# EAGLE design ME433 (EAGLE 9.6.2)
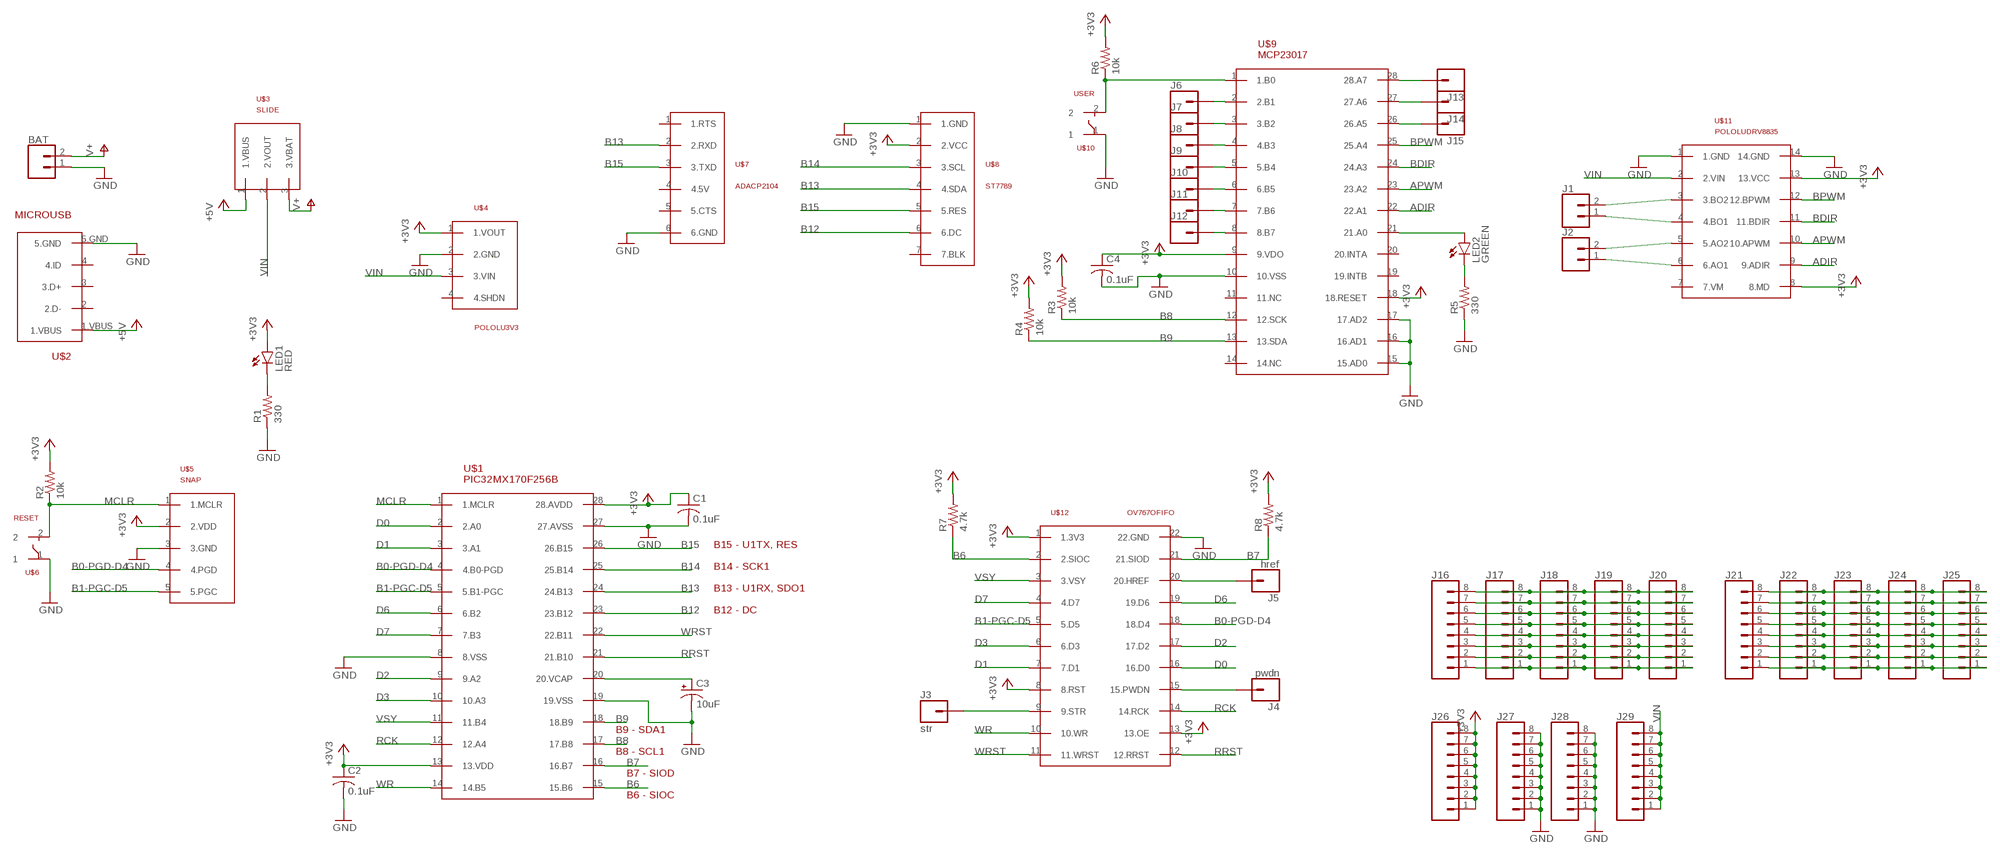
[diagram p0: schematic, sheet 1]

## Parts
BAT  CONN_02  [1X02]
C1  0.1uF  C-US025-030X050  [C025-030X050]
C2  0.1uF  C-US025-030X050  [C025-030X050]
C3  10uF  CPOL-USB45181B  [B45181B]
C4  0.1uF  C-US025-030X050  [C025-030X050]
J1  CONN_02  [1X02]
J2  CONN_02  [1X02]
J3  str  CONN_01  [1X01]
J4  pwdn  CONN_01  [1X01]
J5  href  CONN_01  [1X01]
J6  CONN_01  [1X01]
J7  CONN_01  [1X01]
J8  CONN_01  [1X01]
J9  CONN_01  [1X01]
J10  CONN_01  [1X01]
J11  CONN_01  [1X01]
J12  CONN_01  [1X01]
J13  CONN_01  [1X01]
J14  CONN_01  [1X01]
J15  CONN_01  [1X01]
J16  CONN_08"  [1X08]
J17  CONN_08"  [1X08]
J18  CONN_08"  [1X08]
J19  CONN_08"  [1X08]
J20  CONN_08"  [1X08]
J21  CONN_08"  [1X08]
J22  CONN_08"  [1X08]
J23  CONN_08"  [1X08]
J24  CONN_08"  [1X08]
J25  CONN_08"  [1X08]
J26  CONN_08"  [1X08]
J27  CONN_08"  [1X08]
J28  CONN_08"  [1X08]
J29  CONN_08"  [1X08]
LED1  RED  LED3MM  [LED3MM]
LED2  GREEN  LED3MM  [LED3MM]
R1  330  R-US_0207/10  [0207/10]
R2  10k  R-US_0207/10  [0207/10]
R3  10k  R-US_0207/10  [0207/10]
R4  10k  R-US_0207/10  [0207/10]
R5  330  R-US_0207/10  [0207/10]
R6  10k  R-US_0207/10  [0207/10]
R7  4.7k  R-US_0207/10  [0207/10]
R8  4.7k  R-US_0207/10  [0207/10]
U$1  PIC32MX170F256B  [DIL28-3]
U$2  MICROUSB  [MICROUSB]
U$3  SLIDE  [SLIDE]
U$4  POLOLU3V3  [POLOLU3V3]
U$5  SNAP  [SNAP]
U$6  RESET  PUSH  [PUSH]
U$7  ADACP2104  [ADACP2104]
U$8  ST7789  [ST7789]
U$9  MCP23017  [MCP23017]
U$10  USER  PUSH  [PUSH]
U$11  POLOLUDRV8835  [POLOLUDRV8835]
U$12  OV767OFIFO  [OV767OFIFO]

## Nets
+3V3: C1.1 C2.1 C4.1 J26.1 J26.2 J26.3 J26.4 J26.5 J26.6 J26.7 J26.8 LED1.A R2.2 R3.2 R4.2 R6.2 R7.2 R8.2 U$1.13(13.VDD) U$1.28(28.AVDD) U$4.1(1.VOUT) U$5.2(2.VDD) U$8.2(2.VCC) U$9.9(9.VDO) U$9.18(18.RESET) U$11.8(8.MD) U$11.13(13.VCC) U$12.1(1.3V3) U$12.8(8.RST) U$12.13(13.OE)
+5V: U$2.1.VBUS U$3.1(1.VBUS)
ADIR: U$9.22(22.A1) U$11.9(9.ADIR)
APWM: U$9.23(23.A2) U$11.10.(10.APWM)
B0-PGD-D4: U$1.4(4.B0-PGD) U$5.4(4.PGD) U$12.18(18.D4)
B1-PGC-D5: U$1.5(5.B1-PGC) U$5.5(5.PGC) U$12.5(5.D5)
B6: R7.1 U$1.15(15.B6) U$12.2(2.SIOC)
B7: R8.1 U$1.16(16.B7) U$12.21(21.SIOD)
B8: R3.1 U$1.17(17.B8) U$9.12(12.SCK)
B9: R4.1 U$1.18(18.B9) U$9.13(13.SDA)
B12: U$1.23(23.B12) U$8.6(6.DC)
B13: U$1.24(24.B13) U$7.2(2.RXD) U$8.4(4.SDA)
B14: U$1.25(25.B14) U$8.3(3.SCL)
B15: U$1.26(26.B15) U$7.3(3.TXD) U$8.5(5.RES)
BDIR: U$9.24(24.A3) U$11.11(11.BDIR)
BPWM: U$9.25(25.A4) U$11.12(12.BPWM)
D0: U$1.2(2.A0) U$12.16(16.D0)
D1: U$1.3(3.A1) U$12.7(7.D1)
D2: U$1.9(9.A2) U$12.17(17.D2)
D3: U$1.10(10.A3) U$12.6(6.D3)
D6: U$1.6(6.B2) U$12.19(19.D6)
D7: U$1.7(7.B3) U$12.4(4.D7)
GND: BAT.1 C1.2 C2.2 C3.- C4.2 J27.1 J27.2 J27.3 J27.4 J27.5 J27.6 J27.7 J27.8 J28.1 J28.2 J28.3 J28.4 J28.5 J28.6 J28.7 J28.8 R1.1 R5.1 U$1.8(8.VSS) U$1.19(19.VSS) U$1.27(27.AVSS) U$2.5.GND U$4.2(2.GND) U$5.3(3.GND) U$6.1 U$7.6(6.GND) U$8.1(1.GND) U$9.10(10.VSS) U$9.15(15.AD0) U$9.16(16.AD1) U$9.17(17.AD2) U$10.1 U$11.1(1.GND) U$11.14(14.GND) U$12.22(22.GND)
MCLR: R2.1 U$1.1(1.MCLR) U$5.1(1.MCLR) U$6.2
N$1: LED1.K(C) R1.2
N$2: C3.+ U$1.20(20.VCAP)
N$3: LED2.A U$9.21(21.A0)
N$4: LED2.K(C) R5.2
N$5: R6.1 U$9.1(1.B0) U$10.2
N$6: J1.2 U$11.3(3.BO2)
N$7: J1.1 U$11.4(4.BO1)
N$8: J2.2 U$11.5(5.AO2)
N$9: J2.1 U$11.6(6.AO1)
N$10: J3.1 U$12.9(9.STR)
N$11: J4.1 U$12.15(15.PWDN)
N$12: J5.1 U$12.20(20.HREF)
N$13: J6.1 U$9.2(2.B1)
N$14: J7.1 U$9.3(3.B2)
N$15: J8.1 U$9.4(4.B3)
N$16: J9.1 U$9.5(5.B4)
N$17: J10.1 U$9.6(6.B5)
N$18: J11.1 U$9.7(7.B6)
N$19: J12.1 U$9.8(8.B7)
N$20: J13.1 U$9.28(28.A7)
N$21: J14.1 U$9.27(27.A6)
N$22: J15.1 U$9.26(26.A5)
N$23: J16.8 J17.8 J18.8 J19.8 J20.8
N$24: J16.7 J17.7 J18.7 J19.7 J20.7
N$25: J16.6 J17.6 J18.6 J19.6 J20.6
N$26: J16.5 J17.5 J18.5 J19.5 J20.5
N$27: J16.4 J17.4 J18.4 J19.4 J20.4
N$28: J16.3 J17.3 J18.3 J19.3 J20.3
N$29: J16.2 J17.2 J18.2 J19.2 J20.2
N$30: J16.1 J17.1 J18.1 J19.1 J20.1
N$31: J21.8 J22.8 J23.8 J24.8 J25.8
N$32: J21.7 J22.7 J23.7 J24.7 J25.7
N$33: J21.6 J22.6 J23.6 J24.6 J25.6
N$34: J21.5 J22.5 J23.5 J24.5 J25.5
N$35: J21.4 J22.4 J23.4 J24.4 J25.4
N$36: J21.3 J22.3 J23.3 J24.3 J25.3
N$37: J21.2 J22.2 J23.2 J24.2 J25.2
N$38: J21.1 J22.1 J23.1 J24.1 J25.1
RCK: U$1.12(12.A4) U$12.14(14.RCK)
RRST: U$1.21(21.B10) U$12.12(12.RRST)
V+: BAT.2 U$3.3(3.VBAT)
VIN: J29.1 J29.2 J29.3 J29.4 J29.5 J29.6 J29.7 J29.8 U$3.2(2.VOUT) U$4.3(3.VIN) U$11.2(2.VIN)
VSY: U$1.11(11.B4) U$12.3(3.VSY)
WR: U$1.14(14.B5) U$12.10(10.WR)
WRST: U$1.22(22.B11) U$12.11(11.WRST)
Unconnected: U$2.2(2.D-) U$2.3(3.D+) U$2.4(4.ID) U$4.4(4.SHDN) U$7.1(1.RTS) U$7.4(4.5V) U$7.5(5.CTS) U$8.7(7.BLK) U$9.11(11.NC) U$9.14(14.NC) U$9.19(19.INTB) U$9.20(20.INTA) U$11.7(7.VM)

## Notes on the sheet
- B15 - U1TX, RES
- B14 - SCK1
- B13 - U1RX, SDO1
- B12 - DC
- B9 - SDA1
- B8 - SCL1
- B7 - SIOD
- B6 - SIOC

## Library data of the parts
BAT J1 J2 = ME433:CONN_02: Multi connection point. Often used as Generic Header-pin footprint for 0.1 inch spaced/style header connections On any of the 0.1 inch spaced packages, you can populate with these: Break Away Headers - Straight <https://www.sparkfun.com/products/116> (PRT-00116) Break Away Male Headers - Right Angle <https://www.sparkfun.com/products/553> (PRT-00553) Female Headers <https://www.sparkfun.com/products/115> (PRT-00115) Break Away Headers - Machine Pin <https://www.sparkfun.com/products/117> (PRT-00117) Break Away Female Headers - Swiss Machine Pin <https://www.sparkfun.com/products/743> (PRT-00743) For SCREWTERMINALS and SPRING TERMINALS visit here: Screw Terimnals on SparkFun.com <https://www.sparkfun.com/search/results?term=Screw+Terminals> (5mm/3.5mm/2.54mm spacing) This device is also useful as a general connection point to wire up your design to another part of your project. Our various solder wires solder well into these plated through hole pads. Hook-Up Wire - Assortment (Stranded, 22 AWG) <https://www.sparkfun.com/products/11375> (PRT-11375) Hook-Up Wire - Assortment (Solid Core, 22 AWG) <https://www.sparkfun.com/products/11367> (PRT-11367) View the entire wire category on our website here <https://www.sparkfun.com/categories/141> Special notes: Molex polarized connector foot print use with: PRT-08233 with associated crimp pins and housings. 2.54_SCREWTERM for use with PRT-10571. 3.5mm Screw Terminal footprints for PRT-08084 5mm Screw Terminal footprints for use with PRT-08432
C1 C2 C4 = ME433:C-US: CAPACITOR, American symbol; SPICEPREFIX: C
C3 = ME433:CPOL-US: POLARIZED CAPACITOR, American symbol; SPICEPREFIX: C
J3-J15 = ME433:CONN_01: Single connection point. Often used as Generic Header-pin footprint for 0.1 inch spaced/style header connections On any of the 0.1 inch spaced packages, you can populate with these: Break Away Headers - Straight <https://www.sparkfun.com/products/116> (PRT-00116) Break Away Male Headers - Right Angle <https://www.sparkfun.com/products/553> (PRT-00553) Female Headers <https://www.sparkfun.com/products/115> (PRT-00115) Break Away Headers - Machine Pin <https://www.sparkfun.com/products/117> (PRT-00117) Break Away Female Headers - Swiss Machine Pin <https://www.sparkfun.com/products/743> (PRT-00743) This device is also useful as a general connection point to wire up your design to another part of your project. Our various solder wires solder well into these plated through hole pads. Hook-Up Wire - Assortment (Stranded, 22 AWG) <https://www.sparkfun.com/products/11375> (PRT-11375) Hook-Up Wire - Assortment (Solid Core, 22 AWG) <https://www.sparkfun.com/products/11367> (PRT-11367) View the entire wire category on our website here <https://www.sparkfun.com/categories/141> Special notes: SMTSO-256-ET is a "flush mount" nut for a 4-40 screw. We mostly use this on specialty testbeds; it is a nice way to connect hardware to your PCB at an adjustable hieght. Also note, the SNAP packages are for using a snappable style connector. We sell a baggie of snaps and they are also used on two LilyPad designs: Snap Assortment - 30 pack (male and female) <https://www.sparkfun.com/products/11347> (DEV-11347) LilyPad Arduino SimpleSnap <https://www.sparkfun.com/products/10941> (DEV-10941) LilyPad SimpleSnap Protoboard <https://www.sparkfun.com/products/10940> (DEV-10940)
J16-J29 = ME433:CONN_08: Multi connection point. Often used as Generic Header-pin footprint for 0.1 inch spaced/style header connections On any of the 0.1 inch spaced packages, you can populate with these: Break Away Headers - Straight <https://www.sparkfun.com/products/116> (PRT-00116) Break Away Male Headers - Right Angle <https://www.sparkfun.com/products/553> (PRT-00553) Female Headers <https://www.sparkfun.com/products/115> (PRT-00115) Break Away Headers - Machine Pin <https://www.sparkfun.com/products/117> (PRT-00117) Break Away Female Headers - Swiss Machine Pin <https://www.sparkfun.com/products/743> (PRT-00743) Arduino Stackable Header - 8 Pin <https://www.sparkfun.com/products/9279> (PRT-09279) For SCREWTERMINALS and SPRING TERMINALS visit here: Screw Terimnals on SparkFun.com <https://www.sparkfun.com/search/results?term=Screw+Terminals> (5mm/3.5mm/2.54mm spacing) This device is also useful as a general connection point to wire up your design to another part of your project. Our various solder wires solder well into these plated through hole pads. Hook-Up Wire - Assortment (Stranded, 22 AWG) <https://www.sparkfun.com/products/11375> (PRT-11375) Hook-Up Wire - Assortment (Solid Core, 22 AWG) <https://www.sparkfun.com/products/11367> (PRT-11367) View the entire wire category on our website here <https://www.sparkfun.com/categories/141> Special notes: Molex polarized connector foot print use with SKU : PRT-08231 with associated crimp pins and housings. 1MM SMD Version SKU: PRT-10208 NOTES ON THE VARIANTS LOCK and LOCK_LONGPADS... This footprint was designed to help hold the alignment of a through-hole component (i.e. 6-pin header) while soldering it into place. You may notice that each hole has been shifted either up or down by 0.005 of an inch from it's more standard position (which is a perfectly straight line). This slight alteration caused the pins (the squares in the middle) to touch the edges of the holes. Because they are alternating, it causes a "brace" to hold the component in place. 0.005 has proven to be the perfect amount of "off-center" position when using our standard breakaway headers. Although looks a little odd when you look at the bare footprint, once you have a header in there, the alteration is very hard to notice. Also,if you push a header all the way into place, it is covered up entirely on the bottom side.; PROD_ID: CONN-08438
LED1 LED2 = ME433:LED: LED OSRAM: - CHIPLED LG R971, LG N971, LY N971, LG Q971, LY Q971, LO R971, LY R971 LH N974, LH R974 LS Q976, LO Q976, LY Q976 LO Q996 - Hyper CHIPLED LW Q18S LB Q993, LB Q99A, LB R99A - SideLED LS A670, LO A670, LY A670, LG A670, LP A670 LB A673, LV A673, LT A673, LW A673 LH A674 LY A675 LS A676, LA A676, LO A676, LY A676, LW A676 LS A679, LY A679, LG A679 - Hyper Micro SIDELED® LS Y876, LA Y876, LO Y876, LY Y876 LT Y87S - SmartLED LW L88C, LW L88S LB L89C, LB L89S, LG L890 LS L89K, LO L89K, LY L89K LS L896, LA L896, LO L896, LY L896 - TOPLED LS T670, LO T670, LY T670, LG T670, LP T670 LSG T670, LSP T670, LSY T670, LOP T670, LYG T670 LG T671, LOG T671, LSG T671 LB T673, LV T673, LT T673, LW T673 LH T674 LS T676, LA T676, LO T676, LY T676, LB T676, LH T676, LSB T676, LW T676 LB T67C, LV T67C, LT T67C, LS T67K, LO T67K, LY T67K, LW E67C LS E67B, LA E67B, LO E67B, LY E67B, LB E67C, LV E67C, LT E67C LW T67C LS T679, LY T679, LG T679 LS T770, LO T770, LY T770, LG T770, LP T770 LB T773, LV T773, LT T773, LW T773 LH T774 LS E675, LA E675, LY E675, LS T675 LS T776, LA T776, LO T776, LY T776, LB T776 LHGB T686 LT T68C, LB T68C - Hyper Mini TOPLED® LB M676 - Mini TOPLED Santana® LG M470 LS M47K, LO M47K, LY M47K Source: http://www.osram.convergy.de LUXEON: - LUMILED® LXK2-PW12-R00, LXK2-PW12-S00, LXK2-PW14-U00, LXK2-PW14-V00 LXK2-PM12-R00, LXK2-PM12-S00, LXK2-PM14-U00 LXK2-PE12-Q00, LXK2-PE12-R00, LXK2-PE12-S00, LXK2-PE14-T00, LXK2-PE14-U00 LXK2-PB12-K00, LXK2-PB12-L00, LXK2-PB12-M00, LXK2-PB14-N00, LXK2-PB14-P00, LXK2-PB14-Q00 LXK2-PR12-L00, LXK2-PR12-M00, LXK2-PR14-Q00, LXK2-PR14-R00 LXK2-PD12-Q00, LXK2-PD12-R00, LXK2-PD12-S00 LXK2-PH12-R00, LXK2-PH12-S00 LXK2-PL12-P00, LXK2-PL12-Q00, LXK2-PL12-R00 Source: www.luxeon.com KINGBRIGHT: KA-3528ASYC Source: www.kingbright.com
R1-R8 = ME433:R-US_: RESISTOR, American symbol; SPICEPREFIX: R
U$1 = ME433:PIC32MX170F256B
U$2 = ME433:MICROUSB
U$3 = ME433:SLIDE
U$4 = ME433:POLOLU3V3
U$5 = ME433:SNAP
U$6 U$10 = ME433:PUSH
U$7 = ME433:ADACP2104
U$8 = ME433:ST7789
U$9 = ME433:MCP23017
U$11 = ME433:POLOLUDRV8835
U$12 = ME433:OV767OFIFO

## Board
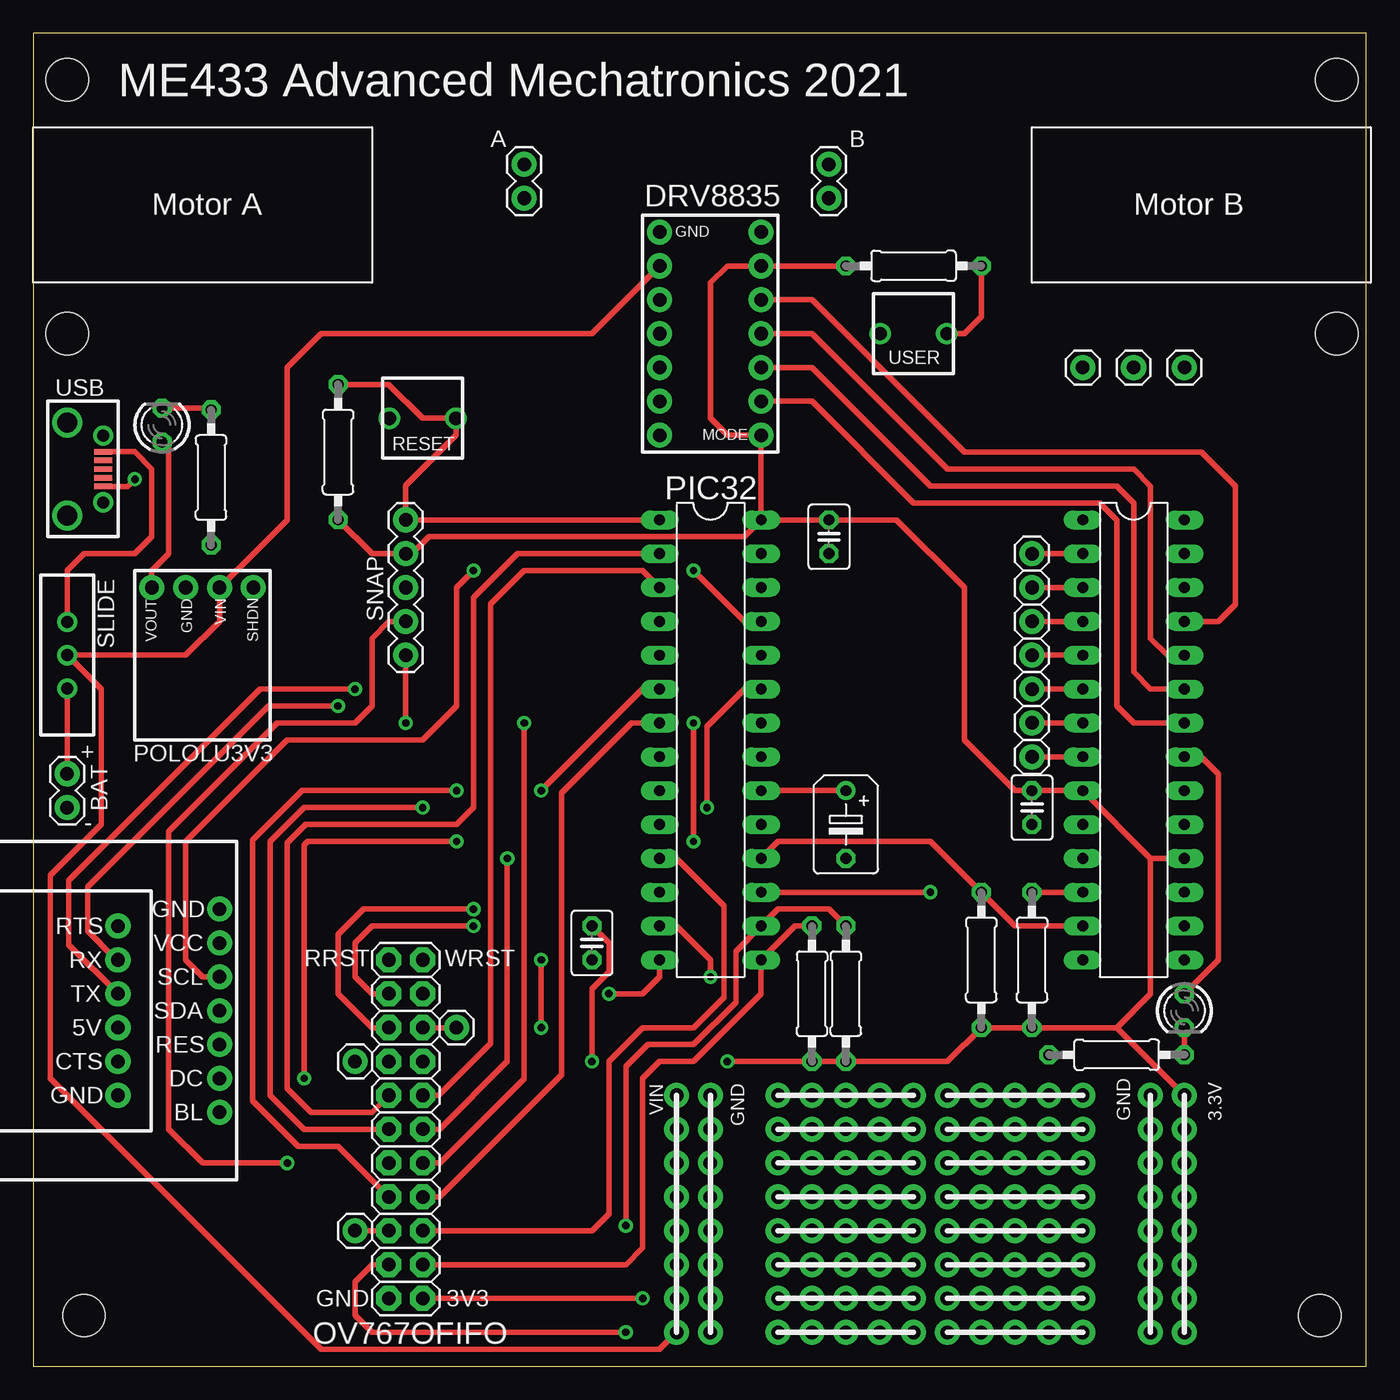
[diagram p1: board, top side]
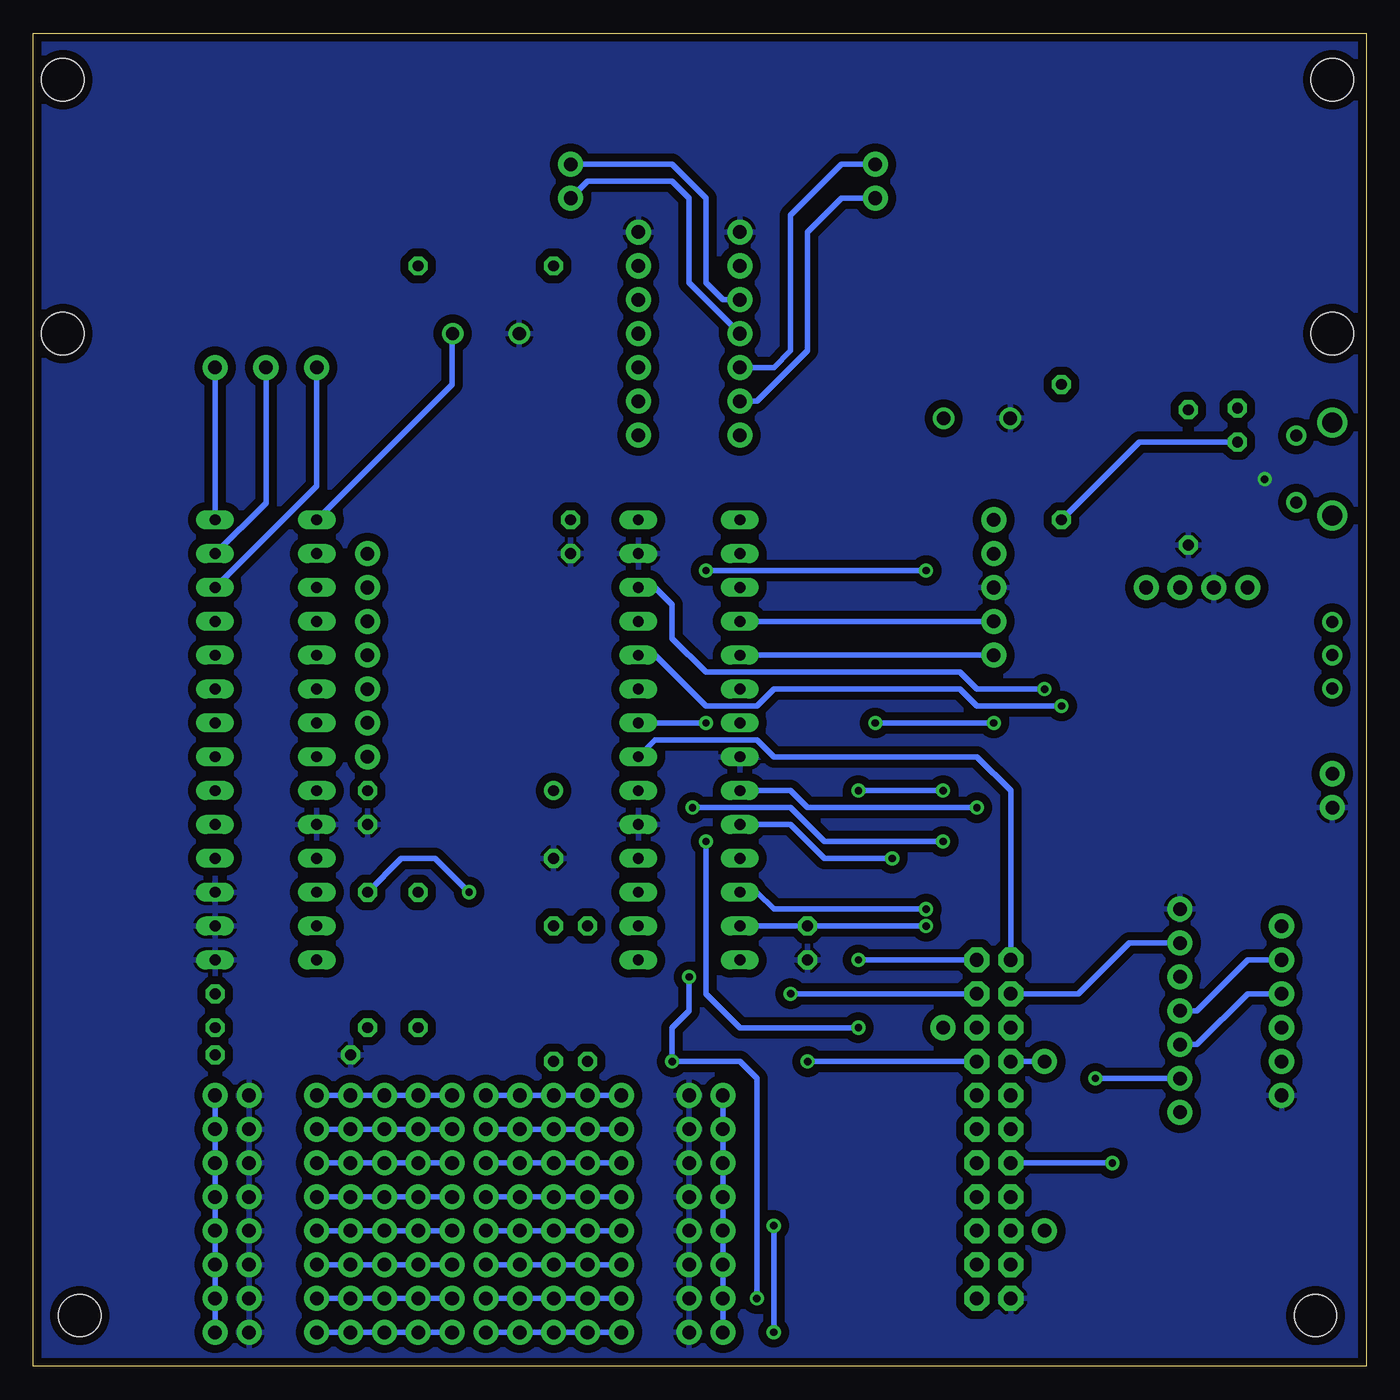
[diagram p2: board, bottom side, seen from below]

Size 100 x 100 mm. Coordinates in mm from the lower left corner, seen from the top.
Outline: 0,0 100,0 100,100 0,100 0,0
Copper layers (1*16): Top 0.035mm / dielectric 1.5mm / Bottom 0.035mm
Design rules "SparkFun": minimum track width 8mil, minimum drill 20mil, track to track 8mil, track to pad 8mil, pad to pad 8mil, via to via 8mil, smd to smd 8mil, copper to edge 8mil, drill to drill 8mil, minimum pad ring 12mil, minimum via ring 10mil, stop-mask expansion 4mil, vias tented up to drill 20mil, thermal gap 10mil
Holes 3.17 mm at 2.54,96.52 2.54,77.47 97.79,96.52 97.79,77.47 3.81,3.81 96.52,3.81

### Footprints (pad centres in the part's own frame; a part is rotated, then mirrored left to right if it is on the bottom)
1X02 = drill 1.016 pad 1.88: 1 0,0; 2 2.54,0
C025-030X050 = drill 0.813 octagon: 1 -1.27,0; 2 1.27,0
B45181B = drill 0.813: + -2.54,0 | drill 0.813 octagon: - 2.54,0
1X01 = drill 1.016 pad 1.88: 1 0,0
1X08 = drill 1.016 pad 1.88: 1 0,0; 2 2.54,0; 3 5.08,0; 4 7.62,0; 5 10.16,0; 6 12.7,0; 7 15.24,0; 8 17.78,0
LED3MM = drill 0.813 octagon: A -1.27,0; K 1.27,0
0207/10 = drill 0.813 octagon: 1 -5.08,0; 2 5.08,0
DIL28-3 = drill 0.813 long: 1 -16.51,-3.81; 2 -13.97,-3.81; 3 -11.43,-3.81; 4 -8.89,-3.81; 5 -6.35,-3.81; 6 -3.81,-3.81; 7 -1.27,-3.81; 8 1.27,-3.81; 9 3.81,-3.81; 10 6.35,-3.81; 11 8.89,-3.81; 12 11.43,-3.81; 13 13.97,-3.81; 14 16.51,-3.81; 15 16.51,3.81; 16 13.97,3.81; 17 11.43,3.81; 18 8.89,3.81; 19 6.35,3.81; 20 3.81,3.81; 21 1.27,3.81; 22 -1.27,3.81; 23 -3.81,3.81; 24 -6.35,3.81; 25 -8.89,3.81; 26 -11.43,3.81; 27 -13.97,3.81; 28 -16.51,3.81
MICROUSB = smd 0.4 x 1.35: 1.VBUS -1.3,2.7; 2 -0.65,2.7; 3 0,2.7; 4 0.65,2.7; 5.GND 1.3,2.7 | drill 0.9: P$6 -2.5,2.7; P$7 2.5,2.7 | drill 1.5: P$8 -3.5,0; P$9 3.5,0
SLIDE = drill 0.9: 1 -2.5,0; 2 0,0; 3 2.5,0
POLOLU3V3 = drill 1.016 pad 1.88: 1 0,3.81; 2 0,1.27; 3 0,-1.27; 4 0,-3.81
SNAP = drill 1.016 pad 1.88: 1 0,5.08; 2 0,2.54; 3 0,0; 4 0,-2.54; 5 0,-5.08
PUSH = drill 1: 1 -2.5,0; 2 2.5,0
ADACP2104 = drill 1.016 pad 1.88: 1 0,6.35; 2 0,3.81; 3 0,1.27; 4 0,-1.27; 5 0,-3.81; 6 0,-6.35
ST7789 = drill 1.016 pad 1.88: 1 0,7.62; 2 0,5.08; 3 0,2.54; 4 0,0; 5 0,-2.54; 6 0,-5.08; 7 0,-7.62
MCP23017 = drill 0.813 long: 1 -3.81,16.51; 2 -3.81,13.97; 3 -3.81,11.43; 4 -3.81,8.89; 5 -3.81,6.35; 6 -3.81,3.81; 7 -3.81,1.27; 8 -3.81,-1.27; 9 -3.81,-3.81; 10 -3.81,-6.35; 11 -3.81,-8.89; 12 -3.81,-11.43; 13 -3.81,-13.97; 14 -3.81,-16.51; 15 3.81,-16.51; 16 3.81,-13.97; 17 3.81,-11.43; 18 3.81,-8.89; 19 3.81,-6.35; 20 3.81,-3.81; 21 3.81,-1.27; 22 3.81,1.27; 23 3.81,3.81; 24 3.81,6.35; 25 3.81,8.89; 26 3.81,11.43; 27 3.81,13.97; 28 3.81,16.51
POLOLUDRV8835 = drill 1.016 pad 1.88: 1 -3.81,7.62; 2 -3.81,5.08; 3 -3.81,2.54; 4 -3.81,0; 5 -3.81,-2.54; 6 -3.81,-5.08; 7 -3.81,-7.62; 8 3.81,-7.62; 9 3.81,-5.08; 10. 3.81,-2.54; 11 3.81,0; 12 3.81,2.54; 13 3.81,5.08; 14 3.81,7.62
OV767OFIFO = drill 1.016 pad 1.88 octagon: 1 -1.27,11.43; 2 -1.27,8.89; 3 -1.27,6.35; 4 -1.27,3.81; 5 -1.27,1.27; 6 -1.27,-1.27; 7 -1.27,-3.81; 8 -1.27,-6.35; 9 -1.27,-8.89; 10 -1.27,-11.43; 11 -1.27,-13.97; 12 1.27,-13.97; 13 1.27,-11.43; 14 1.27,-8.89; 15 1.27,-6.35; 16 1.27,-3.81; 17 1.27,-1.27; 18 1.27,1.27; 19 1.27,3.81; 20 1.27,6.35; 21 1.27,8.89; 22 1.27,11.43

### Placement (x,y rotation side)
BAT  2.54,41.91 90 top
C1  59.69,62.23 270 top
C2  41.91,31.75 270 top
C3  60.96,40.64 270 top
C4  74.93,41.91 270 top
J1  59.69,87.63 90 top
J2  36.83,87.63 90 top
J3  31.75,25.4 90 top
J4  24.13,22.86 90 top
J5  24.13,10.16 90 top
J6  74.93,60.96 90 top
J7  74.93,58.42 90 top
J8  74.93,55.88 90 top
J9  74.93,53.34 90 top
J10  74.93,50.8 90 top
J11  74.93,48.26 90 top
J12  74.93,45.72 90 top
J13  86.36,74.93 90 top
J14  82.55,74.93 90 top
J15  78.74,74.93 90 top
J16  55.88,2.54 90 top
J17  58.42,2.54 90 top
J18  60.96,2.54 90 top
J19  63.5,2.54 90 top
J20  66.04,2.54 90 top
J21  68.58,2.54 90 top
J22  71.12,2.54 90 top
J23  73.66,2.54 90 top
J24  76.2,2.54 90 top
J25  78.74,2.54 90 top
J26  86.36,2.54 90 top
J27  50.8,2.54 90 top
J28  83.82,2.54 90 top
J29  48.26,2.54 90 top
LED1  9.65,70.61 90 top
LED2  86.36,26.67 270 top
R1  13.34,66.67 90 top
R2  22.86,68.58 270 top
R3  74.93,30.48 270 top
R4  71.12,30.48 270 top
R5  81.28,23.37 0 top
R6  66.04,82.55 180 top
R7  58.42,27.94 270 top
R8  60.96,27.94 270 top
U$1  50.8,46.99 270 top
U$2  2.54,67.31 270 top
U$3  2.54,53.34 270 top
U$4  12.7,58.42 90 top
U$5  27.94,58.42 0 top
U$6  29.21,71.12 0 top
U$7  6.35,26.67 0 top
U$8  13.97,26.67 0 top
U$9  82.55,46.99 0 top
U$10  66.04,77.47 0 top
U$11  50.8,77.47 0 top
U$12  27.94,16.51 180 top

### Tracks (layer width: path | path; a pad name or v marks a point on that pad's centre or on a via)
+3V3  (via drill 0.55)
  Top 0.406: U$4.1 8.89,59.69 10.16,60.96 10.16,68.83 LED1.A | R2.2 25.4,60.96 U$5.2 28.42,60.96 29.69,62.23 53.34,62.23 U$1.28 | U$1.28 C1.1 64.77,63.5 69.85,58.42 69.85,46.99 73.66,43.18 C4.1 U$9.9 83.82,38.1 | U$1.28 U$11.8 52.07,69.85 50.8,71.12 50.8,81.28 52.07,82.55 U$11.13 R6.2 | U$12.1 v45.72,5.08 | v52.07,22.86 R7.2 R8.2 68.58,22.86 R4.2 R3.2 81.28,25.4 | 81.28,25.4 J26.8 | 81.28,25.4 83.82,27.94 83.82,38.1 | 83.82,38.1 U$9.18 | v41.91,22.86 41.91,28.32 43.18,29.59 43.18,31.75 C2.1 | U$12.13 25.4,27.94 24.13,29.21 24.13,31.75 25.4,33.02 v33.02,33.02 | v50.8,29.21 50.8,30.48 48.26,33.02 U$1.13
  Bottom 0.406: R2.2 17.02,69.34 LED1.A | v45.72,5.08 45.72,21.59 46.99,22.86 v52.07,22.86 52.07,25.4 50.8,26.67 v50.8,29.21 | U$8.2 17.78,31.75 21.59,27.94 U$12.13 | U$12.8 v41.91,22.86 | U$1.13 C2.1 v33.02,33.02 | J26.8 J26.7 J26.6 J26.5 J26.4 J26.3 J26.2 J26.1
+5V
  Top 0.406: U$3.1 2.54,59.69 3.81,60.96 7.62,60.96 8.89,62.23 8.89,67.31 7.59,68.61 U$2.1.VBUS
ADIR
  Top 0.406: U$9.22 82.55,48.26 81.28,49.53 81.28,63.5 80.01,64.77 66.04,64.77 58.42,72.39 U$11.9
APWM
  Top 0.406: U$9.23 83.82,50.8 82.55,52.07 82.55,64.77 81.28,66.04 67.31,66.04 58.42,74.93 U$11.10.
B0-PGD-D4  (via drill 0.55)
  Top 0.406: v19.05,15.24 12.7,15.24 10.16,17.78 10.16,40.13 18.29,48.26 24.13,48.26 25.4,49.53 25.4,54.61 26.67,55.88 U$5.4
  Bottom 0.406: U$12.18 v19.05,15.24 | U$5.4 U$1.4
B1-PGC-D5  (via drill 0.55)
  Top 0.406: U$12.5 30.51,15.24 36.83,21.56 v36.83,48.26 | v27.94,48.26 U$5.5
  Bottom 0.406: U$5.5 U$1.5 | v36.83,48.26 v27.94,48.26
B6
  Top 0.406: R7.1 57.15,33.02 U$1.15 54.61,27.94 49.53,22.86 46.99,22.86 45.72,21.59 45.72,8.89 44.45,7.62 U$12.2
B7  (via drill 0.55)
  Top 0.406: U$12.21 25.4,7.62 24.13,6.35 24.13,3.81 25.4,2.54 v44.45,2.54 | R8.1 59.69,34.29 55.88,34.29 U$1.16 52.7,31.11 52.7,27.3 49.53,24.13 46.1,24.13 44.45,22.48 v44.45,10.54
  Bottom 0.406: v44.45,2.54 v44.45,10.54
B8  (via drill 0.55)
  Top 0.406: U$1.17 v67.31,35.56 | R3.1 U$9.12
  Bottom 0.406: R3.1 72.39,38.1 69.85,38.1 v67.31,35.56
B9
  Top 0.406: U$9.13 73.66,33.02 R4.1 67.31,39.37 55.88,39.37 U$1.18
B12  (via drill 0.55)
  Top 0.406: v50.55,41.91 50.55,48.01 53.34,50.8 U$1.23 | v31.75,39.37 20.57,39.37 20.32,39.12 v20.32,21.59
  Bottom 0.406: U$8.6 v20.32,21.59 | v31.75,39.37 40.64,39.37 43.18,41.91 v50.55,41.91
B13  (via drill 0.55)
  Top 0.406: U$7.2 6.22,30.48 4.06,32.64 4.06,35.94 17.65,49.53 v22.86,49.53
  Bottom 0.406: U$7.2 8.89,30.48 12.7,26.67 U$8.4 | U$1.24 53.34,53.34 49.53,49.53 45.72,49.53 44.45,50.8 30.48,50.8 29.21,49.53 v22.86,49.53
B14  (via drill 0.55)
  Top 0.406: U$8.3 12.7,29.21 11.43,30.48 11.43,39.37 19.05,46.99 29.21,46.99 31.75,49.53 31.75,58.42 v33.02,59.69 | v49.53,59.69 53.34,55.88 U$1.25
  Bottom 0.406: v33.02,59.69 v49.53,59.69
B15  (via drill 0.55)
  Top 0.406: U$7.3 2.67,31.62 2.67,36.45 17.02,50.8 v24.13,50.8
  Bottom 0.406: U$7.3 8.89,27.94 12.7,24.13 U$8.5 | v24.13,50.8 29.21,50.8 30.48,52.07 49.53,52.07 52.07,54.61 52.07,57.15 53.34,58.42 U$1.26
BDIR
  Top 0.406: U$9.24 85.09,53.34 83.82,54.61 83.82,66.04 82.55,67.31 68.58,67.31 58.42,77.47 U$11.11
BPWM
  Top 0.406: U$11.12 58.42,80.01 69.85,68.58 87.63,68.58 90.17,66.04 90.17,57.15 88.9,55.88 U$9.25
D0
  Top 0.406: U$1.2 36.32,60.96 33.02,57.66 33.02,41.91 31.75,40.64 20.45,40.64 19.05,39.24 19.05,20.83 20.83,19.05 25.4,19.05 U$12.16
D1
  Top 0.406: U$1.3 45.72,59.69 36.83,59.69 34.31,57.17 34.31,24.23 30.41,20.32 U$12.7
D2  (via drill 0.55)
  Top 0.406: U$12.17 20.32,17.78 17.78,20.32 17.78,39.37 20.32,41.91 v29.21,41.91
  Bottom 0.406: v29.21,41.91 41.91,41.91 43.18,43.18 U$1.9
D3  (via drill 0.55)
  Top 0.406: U$12.6 30.48,17.78 35.56,22.86 v35.56,38.1
  Bottom 0.406: v35.56,38.1 40.64,38.1 43.18,40.64 U$1.10
D6  (via drill 0.55)
  Top 0.406: v38.1,43.18 45.72,50.8 U$1.6 | U$12.19 22.86,16.51 19.86,16.51 16.46,19.91 16.46,39.47 20.16,43.18 v31.75,43.18
  Bottom 0.406: v38.1,43.18 v31.75,43.18
D7
  Top 0.406: U$12.4 30.48,12.7 39.62,21.84 39.62,42.99 44.89,48.26 U$1.7
GND  (via drill 0.55)
  Top 0.406: U$2.5.GND 7.08,66.01 v7.62,66.55
  pour Bottom (isolate 0.61): 0,0 100.33,0 100.33,100.33 0,100.33
MCLR
  Top 0.406: R2.1 26.67,73.66 29.21,71.12 U$6.2 31.71,69.85 27.94,66.08 U$5.1 U$1.1
N$1
  Top 0.406: LED1.K 13.21,71.88 R1.2
N$2
  Top 0.406: U$1.20 C3.+
N$3
  Top 0.406: LED2.A 88.9,30.48 88.9,44.45 87.63,45.72 U$9.21
N$4
  Top 0.406: R5.2 LED2.K
N$5
  Top 0.406: R6.1 71.12,78.74 69.85,77.47 U$10.2
  Bottom 0.406: U$10.2 68.58,77.43 68.58,73.66 U$9.1
N$6
  Bottom 0.406: U$11.3 48.26,80.01 49.53,81.28 49.53,87.63 52.07,90.17 J1.2
N$7
  Bottom 0.406: U$11.4 50.8,81.28 50.8,87.63 52.07,88.9 58.42,88.9 J1.1
N$8
  Bottom 0.406: J2.2 39.37,90.17 43.18,86.36 43.18,76.2 44.45,74.93 U$11.5
N$9
  Bottom 0.406: J2.1 39.37,87.63 41.91,85.09 41.91,76.2 45.72,72.39 U$11.6
N$10
  Top 0.406: U$12.9 J3.1
N$11
  Bottom 0.406: J4.1 U$12.15
N$12
  Top 0.406: J5.1 U$12.20
N$13
  Top 0.406: J6.1 U$9.2
N$14
  Top 0.406: J7.1 U$9.3
N$15
  Top 0.406: U$9.4 J8.1
N$16
  Top 0.406: J9.1 U$9.5
N$17
  Top 0.406: U$9.6 J10.1
N$18
  Top 0.406: J11.1 U$9.7
N$19
  Top 0.406: J12.1 U$9.8
N$20
  Bottom 0.406: U$9.28 J13.1
N$21
  Bottom 0.406: U$9.27 82.55,64.77 J14.1
N$22
  Bottom 0.406: U$9.26 78.74,66.04 J15.1
N$23
  Bottom 0.406: J16.8 J17.8 J18.8 J19.8 J20.8
N$24
  Bottom 0.406: J16.7 J17.7 J18.7 J19.7 J20.7
N$25
  Bottom 0.406: J16.6 J17.6 J18.6 J19.6 J20.6
N$26
  Bottom 0.406: J16.5 J17.5 J18.5 J19.5 J20.5
N$27
  Bottom 0.406: J20.4 J19.4 J18.4 J17.4 J16.4
N$28
  Bottom 0.406: J16.3 J17.3 J18.3 J19.3 J20.3
N$29
  Bottom 0.406: J20.2 J19.2 J18.2 J17.2 J16.2
N$30
  Bottom 0.406: J16.1 J17.1 J18.1 J19.1 J20.1
N$31
  Bottom 0.406: J21.8 J22.8 J23.8 J24.8 J25.8
N$32
  Bottom 0.406: J25.7 J24.7 J23.7 J22.7 J21.7
N$33
  Bottom 0.406: J21.6 J22.6 J23.6 J24.6 J25.6
N$34
  Bottom 0.406: J25.5 J24.5 J23.5 J22.5 J21.5
N$35
  Bottom 0.406: J21.4 J22.4 J23.4 J24.4 J25.4
N$36
  Bottom 0.406: J25.3 J24.3 J23.3 J22.3 J21.3
N$37
  Bottom 0.406: J21.2 J22.2 J23.2 J24.2 J25.2
N$38
  Bottom 0.406: J25.1 J24.1 J23.1 J22.1 J21.1
RCK  (via drill 0.55)
  Top 0.406: U$12.14 25.4,25.4 22.86,27.94 22.86,32.38 24.77,34.29 v33.02,34.29
  Bottom 0.406: v33.02,34.29 44.45,34.29 45.72,35.56 U$1.12
RRST
  Bottom 0.406: U$1.21 53.34,46.99 45.72,46.99 44.45,45.72 29.21,45.72 26.67,43.18 U$12.12
V+
  Top 0.406: BAT.2 U$3.3
VIN
  Top 0.406: J29.1 46.99,1.27 21.59,1.27 1.27,21.59 1.27,36.83 5.08,40.64 5.08,50.8 U$3.2 11.43,53.34 13.97,55.88 U$4.3 19.05,63.5 19.05,74.93 21.59,77.47 41.91,77.47 U$11.2
  Bottom 0.406: J29.1 J29.2 J29.3 J29.4 J29.5 J29.6 J29.7 J29.8
VSY
  Top 0.406: U$1.11 48.26,38.1 51.82,34.54 51.82,27.69 49.53,25.4 45.72,25.4 43.18,22.86 43.18,11.43 41.91,10.16 U$12.3
WR  (via drill 0.55)
  Top 0.406: U$1.14 46.99,29.21 45.72,27.94 v43.18,27.94
  Bottom 0.406: U$12.10 v43.18,27.94
WRST  (via drill 0.55)
  Top 0.406: v38.1,30.48 v38.1,25.4 | v49.53,39.37 v49.53,48.26
  Bottom 0.406: U$12.11 v38.1,30.48 | v38.1,25.4 46.99,25.4 49.53,27.94 v49.53,39.37 | v49.53,48.26 U$1.22

### Text on the board
tPlace: ME433 Advanced Mechatronics 2021 | A | B | DRV8835 | Motor A | Motor B | USB | PIC32 | SLIDE | + | BAT | - | RRST | WRST | VIN | GND | GND | 3.3V | GND | 3V3